# EAGLE design ReaXtrobe (EAGLE 9.4.2)
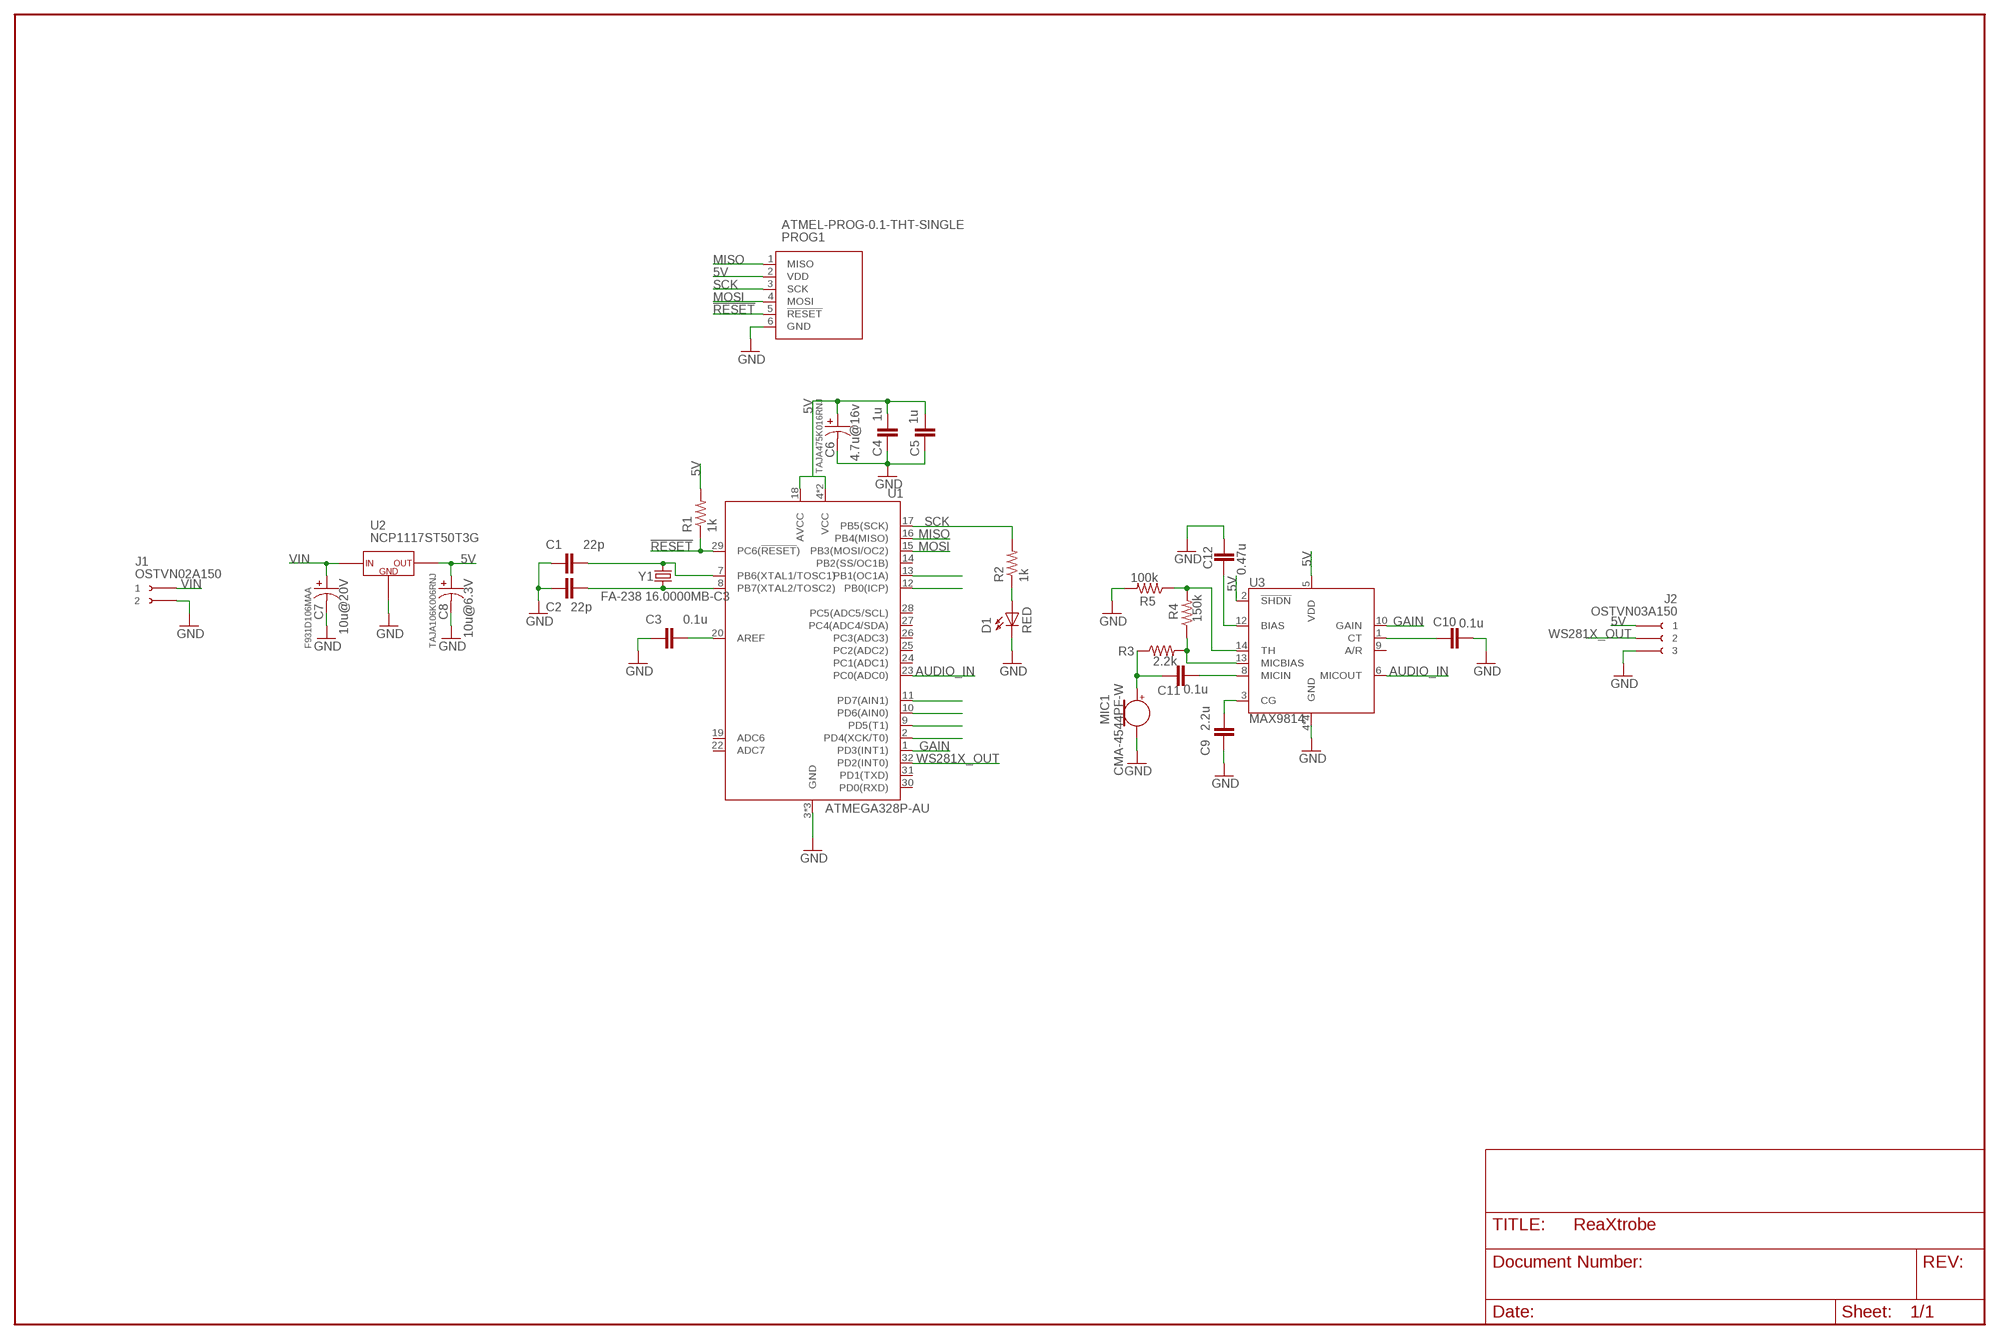
[diagram p0: schematic, sheet 1]

## Parts
C1  22p  CAP-CER-SMD0603  [C0603]
C2  22p  CAP-CER-SMD0603  [C0603]
C3  0.1u  CAP-CER-SMD0603  [C0603]
C4  1u  CAP-CER-SMD0603  [C0603]
C5  1u  CAP-CER-SMD0603  [C0603]
C6  4.7u@16v  CAP-TANT-SMD1206  [CAPMP3216X160]
C7  10u@20V  CAP-TANT-SMD1206  [CAPMP3216X160]
C8  10u@6.3V  CAP-TANT-SMD1206  [CAPMP3216X160]
C9  2.2u  CAP-CER-SMD0603  [C0603]
C10  0.1u  CAP-CER-SMD0603  [C0603]
C11  0.1u  CAP-CER-SMD0603  [C0603]
C12  0.47u  CAP-CER-SMD0603  [C0603]
D1  RED  LED-0603  [CHIP-LED0603]
J1  OSTVN02A150  [OSTVN02A150]
J2  OSTVN03A150  [OSTVN03A150]
MIC1  CMA-4544PF-W  [MIC_CMA-4544PF-W]
PROG1  ATMEL-PROG-0.1-THT-SINGLE  [HEADER-0.1-6]
R1  1k  RES-SMD0603  [R0603]
R2  1k  RES-SMD0603  [R0603]
R3  2.2k  RES-SMD0603  [R0603]
R4  150k  RES-SMD0603  [R0603]
R5  100k  RES-SMD0603  [R0603]
U1  ATMEGA328P-AU  [QFP80P900X900X120-32]
U2  NCP1117ST50T3G  [SOT223]
U3  MAX9814  [SON40P300X300X80-15T170X230]
Y1  FA-238 16.0000MB-C3  CRYSTAL-SMD-43.2X2.5L  [OSCCC320X250X70]

## Nets
5V: C4.2 C5.2 C6.A C8.A J2.P$1 PROG1.2(VDD) R1.2 U1.4(VCC) U1.6(VCC) U1.18(AVCC) U2.2(OUT) U3.2(!SHDN) U3.5(VDD)
!RESET: PROG1.5(!RESET) R1.1 U1.29(PC6(!RESET!))
AUDIO_IN: U1.23(PC0(ADC0)) U3.6(MICOUT)
GAIN: U1.1(PD3(INT1)) U3.10(GAIN)
GND: C1.1 C2.1 C3.1 C4.1 C5.1 C6.C C7.C C8.C C9.1 C10.1 C12.1 D1.C(K) J1.P$2 J2.P$3 MIC1.2(N) PROG1.6(GND) R5.2 U1.3(GND) U1.5(GND) U1.21(GND) U2.1(GND) U3.4(GND) U3.7(GND) U3.11(GND) U3.15(GND)
MISO: PROG1.1(MISO) U1.16(PB4(MISO))
MOSI: PROG1.4(MOSI) U1.15(PB3(MOSI/OC2))
N$1: C2.2 U1.8(PB7(XTAL2/TOSC2)) Y1.1
N$2: C1.2 U1.7(PB6(XTAL1/TOSC1)) Y1.3
N$3: C3.2 U1.20(AREF)
N$4: D1.A R2.1
N$5: C9.2 U3.3(CG)
N$6: C10.2 U3.1(CT)
N$7: C11.1 U3.8(MICIN)
N$8: C11.2 MIC1.1(P) R3.1
N$9: R3.2 R4.1 U3.13(MICBIAS)
N$10: R4.2 R5.1 U3.14(TH)
N$11: C12.2 U3.12(BIAS)
N$14: U1.2(PD4(XCK/T0))
N$15: U1.9(PD5(T1))
N$16: U1.10(PD6(AIN0))
N$17: U1.11(PD7(AIN1))
N$18: U1.12(PB0(ICP))
N$19: U1.13(PB1(OC1A))
SCK: PROG1.3(SCK) R2.2 U1.17(PB5(SCK))
VIN: C7.A J1.P$1 U2.3(IN)
WS281X_OUT: J2.P$2 U1.32(PD2(INT0))
Unconnected: U1.14(PB2(SS/OC1B)) U1.19(ADC6) U1.22(ADC7) U1.24(PC1(ADC1)) U1.25(PC2(ADC2)) U1.26(PC3(ADC3)) U1.27(PC4(ADC4/SDA)) U1.28(PC5(ADC5/SCL)) U1.30(PD0(RXD)) U1.31(PD1(TXD)) U3.9(A/R)

## Notes on the sheet
- TAJA475K016RNJ
- F931D106MAA | TAJA106K006RNJ

## Library data of the parts
C1-C5 C9-C12 = roomready:CAP-CER-SMD
C6-C8 = roomready:CAP-TANT-SMD
D1 = roomready:LED-0603
J1 = roomready:OSTVN02A150
J2 = roomready:OSTVN03A150
MIC1 = roomready:CMA-4544PF-W
PROG1 = roomready:ATMEL-PROG-0.1-THT-SINGLE
R1-R5 = roomready:RES-SMD
U1 = roomready:ATMEGA328P-AU
U2 = roomready:NCP1117ST50T3G
U3 = roomready:MAX9814
Y1 = roomready:CRYSTAL-SMD-4

## Board
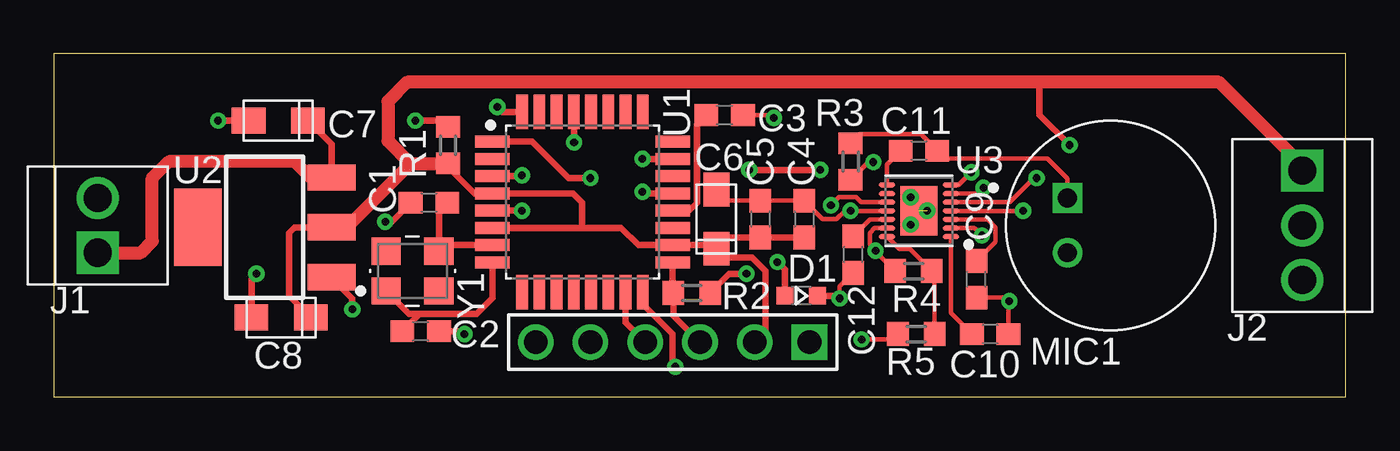
[diagram p1: board, top side]
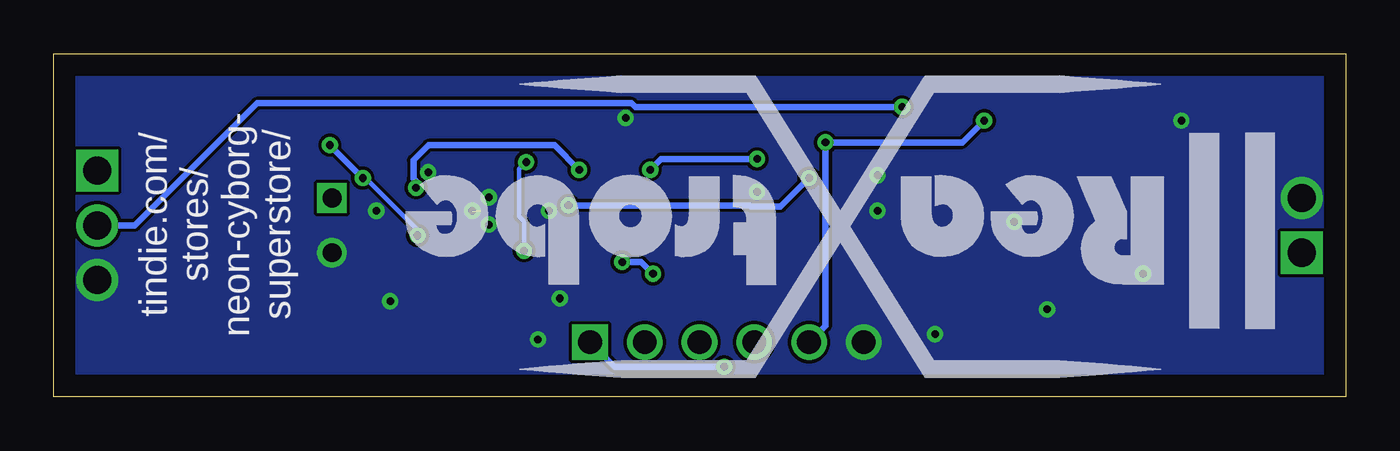
[diagram p2: board, bottom side, seen from below]

Size 59.92 x 15.93 mm. Coordinates in mm from the lower left corner, seen from the top.
Outline: 0,0 59.92,0 59.92,15.93 0,15.93 0,0
Copper layers (1*16): Top 0.035mm / dielectric 1.5mm / Bottom 0.035mm
Design rules "default": minimum track width 6mil, minimum drill 0.35mm, track to track 6mil, track to pad 6mil, pad to pad 6mil, via to via 6mil, smd to smd 6mil, copper to edge 40mil, drill to drill 6mil, minimum pad ring 10mil, minimum via ring 8mil, stop-mask expansion 4mil, vias tented up to drill 0mil, thermal gap 10mil

### Footprints (pad centres in the part's own frame; a part is rotated, then mirrored left to right if it is on the bottom)
C0603 = smd 1.1 x 1: 1 -0.85,0; 2 0.85,0
CAPMP3216X160 = smd 1.562 x 1.212: A -1.375,0; C 1.375,0
CHIP-LED0603 = smd 0.8 x 0.8: A 0,-0.75; C 0,0.75
OSTVN02A150 = drill 1.3 square: P$1 -1.27,0 | drill 1.3: P$2 1.27,0
OSTVN03A150 = drill 1.3 square: P$1 -2.54,0 | drill 1.3: P$2 0,0; P$3 2.54,0
MIC_CMA-4544PF-W = drill 0.87 square: 1 2,-1.27 | drill 0.87: 2 2,1.27
HEADER-0.1-6 = drill 1.1 square: 1 -6.35,0 | drill 1.1: 2 -3.81,0; 3 -1.27,0; 4 1.27,0; 5 3.81,0; 6 6.35,0
R0603 = smd 1 x 1.1: 1 -0.85,0; 2 0.85,0
QFP80P900X900X120-32 = smd 1.6 x 0.547: 1 -4.181,2.8; 2 -4.181,2; 3 -4.181,1.2; 4 -4.181,0.4; 5 -4.181,-0.4; 6 -4.181,-1.2; 7 -4.181,-2; 8 -4.181,-2.8; 17 4.181,-2.8; 18 4.181,-2; 19 4.181,-1.2; 20 4.181,-0.4; 21 4.181,0.4; 22 4.181,1.2; 23 4.181,2; 24 4.181,2.8 | smd 0.547 x 1.6: 9 -2.8,-4.181; 10 -2,-4.181; 11 -1.2,-4.181; 12 -0.4,-4.181; 13 0.4,-4.181; 14 1.2,-4.181; 15 2,-4.181; 16 2.8,-4.181; 25 2.8,4.181; 26 2,4.181; 27 1.2,4.181; 28 0.4,4.181; 29 -0.4,4.181; 30 -1.2,4.181; 31 -2,4.181; 32 -2.8,4.181
SOT223 = smd 1.219 x 2.235: 1 -2.311,-3.099; 2 0,-3.099; 3 2.311,-3.099 | smd 3.6 x 2.2: 4 0,3.099
SON40P300X300X80-15T170X230 = smd 0.76 x 0.232: 1 -1.485,1.2; 2 -1.485,0.8; 3 -1.485,0.4; 4 -1.485,0; 5 -1.485,-0.4; 6 -1.485,-0.8; 7 -1.485,-1.2; 8 1.485,-1.2; 9 1.485,-0.8; 10 1.485,-0.4; 11 1.485,0; 12 1.485,0.4; 13 1.485,0.8; 14 1.485,1.2 | smd 1.7 x 2.3: 15 0,0
OSCCC320X250X70 = smd 1.362 x 1.262: 1 -1.225,-0.925; 2 1.225,-0.925; 3 1.225,0.925; 4 -1.225,0.925

### Placement (x,y rotation side)
C1  17.4,9.02 0 top
C2  17.02,3.05 180 top
C3  31.11,13.08 180 top
C4  34.8,8.26 270 top
C5  32.77,8.26 270 top
C6  30.73,8.26 90 top
C7  10.41,12.83 180 top
C8  10.54,3.68 180 top
C9  42.8,5.46 90 top
C10  43.43,2.92 180 top
C11  40.13,11.43 0 top
C12  37.08,6.6 90 top
D1  34.67,4.7 270 top
J1  2.03,7.96 90 top
J2  57.91,7.96 270 top
MIC1  49.02,7.96 180 top
PROG1  28.7,2.54 180 top
R1  18.29,11.68 270 top
R2  29.59,4.83 180 top
R3  36.96,10.92 270 top
R4  39.88,5.84 0 top
R5  40.01,2.92 180 top
U1  24.52,9.05 0 top
U2  9.78,7.87 90 top
U3  40.13,8.64 180 top
Y1  16.64,5.84 0 top

### Tracks (layer width: path | path; a pad name or v marks a point on that pad's centre or on a via)
5V  (via drill 0.35)
  Top 0.203: U3.2 42.71,7.84 v43.05,7.49 | U3.5 44.34,9.04 45.47,10.16 v45.59,10.16
  Top 0.305: U1.6 24.51,7.85 | 24.51,7.85 26.32,7.85 27.12,7.05 U1.18 30.57,7.05 C6.A | 24.51,7.85 24.51,9.02 24.08,9.45 U1.4 19.51,9.45 18.29,10.67 R1.2 | C6.A 31.26,7.41 C5.2 C4.2 | C6.A 31.14,6.48 32.38,6.48 33.02,5.84 33.02,3.05 PROG1.2 | C8.A 10.92,4.68 10.92,7.62 11.18,7.87 U2.2 | 45.72,14.61 45.72,13.09 v47.12,11.69
  Top 0.61: U2.2 13.59,7.87 16.55,10.83 | 16.55,10.83 R1.2 | 16.55,10.83 15.49,11.89 15.49,13.72 16.38,14.61 45.72,14.61 54.06,14.61 57.91,10.76 J2.P$1
  Bottom 0.203: v45.59,10.16 45.47,10.16 43.05,7.75 v43.05,7.49
  Bottom 0.305: v47.12,11.69 v45.59,10.16
!RESET  (via drill 0.35)
  Top 0.305: U1.29 v24.12,11.82 v24.13,11.81 | v16.76,12.83 18,12.83 R1.1
  Bottom 0.305: v16.76,12.83 17.78,11.81 v24.13,11.81 24.13,3.3 PROG1.5
AUDIO_IN  (via drill 0.35)
  Top 0.203: U3.6 42.85,9.44 v43.12,9.71
  Top 0.305: U1.23 v27.31,11.05 v27.3,11.05 | v32.26,10.54 v35.56,10.54
  Bottom 0.305: v27.3,11.05 31.75,11.05 v32.26,10.54 | v35.56,10.54 36.7,11.68 42.55,11.68 43.24,10.98 43.24,10.15 43.12,10.03 v43.12,9.71
GAIN  (via drill 0.35)
  Top 0.203: U3.10 37.45,9.04 37.22,9.27 36.43,9.27 v36.05,8.89
  Top 0.305: U1.1 22.19,11.85 23.88,10.16 v24.89,10.16
  Bottom 0.305: v36.05,8.89 27.64,8.89 27.59,8.84 26.21,8.84 v24.89,10.16
GND  (via drill 0.35)  (1 unrouted)
  Top 0.203: U3.11 v36.96,8.64 36.69,8.64 36.31,8.26 35.65,8.26 C4.1 C5.1 31.26,9.11 C6.C | U3.7 41.97,9.84 v42.56,10.43 | U3.4 v44.96,8.64 | R5.2 38.9,2.67 v37.47,2.67 | C12.1 36.45,5.12 v36.45,4.57 | C10.1 44.28,4.41 | 44.28,4.41 v44.32,4.45 | C9.1 44.08,4.61 44.28,4.41 | C3.1 33.27,13.08 v33.4,12.95
  Top 0.305: C1.1 15.66,8.13 v15.37,8.13 | C2.1 18.92,3.05 v19.05,2.92 | U1.5 21.71,8.65 v21.72,8.64 | U1.3 21.68,10.25 v21.72,10.29 | U1.21 27.38,9.45 v27.3,9.53 | D1.C 36.32,4.7 v36.45,4.57 | C8.C 9.17,5.48 v9.4,5.71 | C7.C v7.62,12.83 | U2.1 12.88,5.54 13.84,4.57 v13.84,4.06
  other vias: 39.75,9.27 40.51,8.64 39.75,8
  pour Bottom (no thermals): -1.27,16.51 60.96,16.51 60.96,-1.27 -1.27,-1.27
MISO  (via drill 0.35)
  Top 0.305: v28.83,1.4 28.7,1.52 28.7,2.92 27.32,4.3 U1.16
  Bottom 0.305: PROG1.1 33.91,1.4 v28.83,1.4
MOSI
  Top 0.305: U1.15 26.52,3.45 PROG1.4
N$1
  Top 0.305: U1.8 20.34,4.59 19.6,3.85 16.97,3.85 | 16.97,3.85 16.48,3.85 Y1.1 | C2.2 16.97,3.85
N$2
  Top 0.305: U1.7 18.14,7.05 Y1.3 17.86,8.63 C1.2
N$3
  Top 0.305: U1.20 29.47,8.65 29.82,8.99 29.82,12.64 C3.2
N$4  (via drill 0.35)
  Top 0.305: R2.1 31.33,5.71 v32.13,5.71 | v33.57,6.26 33.92,5.91 D1.A
  Bottom 0.305: v32.13,5.71 32.68,6.26 v33.57,6.26
N$5
  Top 0.203: U3.3 43.33,8.24 43.69,7.87 43.69,7.2 C9.2
N$6
  Top 0.203: C10.2 41.62,3.89 U3.1
N$7
  Top 0.203: U3.8 38.65,10.79 C11.1
N$8
  Top 0.203: R3.1 37.38,12.19 40.22,12.19 C11.2 41.35,11.06 46.09,11.06 47.02,10.13 MIC1.1
N$9  (via drill 0.35)
  Top 0.203: R3.2 37.79,10.9 v38.02,10.9 | R4.1 38.12,6.75 v38.12,6.79 v38.12,6.8 37.85,7.07 37.85,7.62 38.06,7.84 U3.13
  Bottom 0.203: v38.12,6.79 38.12,8.14 38.35,8.37 38.35,10.57 v38.02,10.9
N$10
  Top 0.203: U3.14 39.23,6.86 39.71,6.86 R4.2 40.85,5.71 R5.1
N$11
  Top 0.203: U3.12 37.87,8.24 C12.2
SCK
  Top 0.305: PROG1.3 28.74,3.77 R2.2 28.7,4.87 U1.17
VIN
  Top 0.305: C7.A 12.88,11.74 U2.3
  Top 0.61: U2.3 11.91,10.19 11.18,10.92 5.33,10.92 4.57,10.16 4.57,7.24 4.03,6.69 J1.P$1
WS281X_OUT  (via drill 0.35)
  Top 0.305: U1.32 20.81,13.23 v20.57,13.46
  Bottom 0.305: v20.57,13.46 32.94,13.46 33.12,13.64 50.5,13.64 56.17,7.96 J2.P$2

### Text on the board
bNames: tindie.com/ / stores/ / neon-cyborg- / superstore/